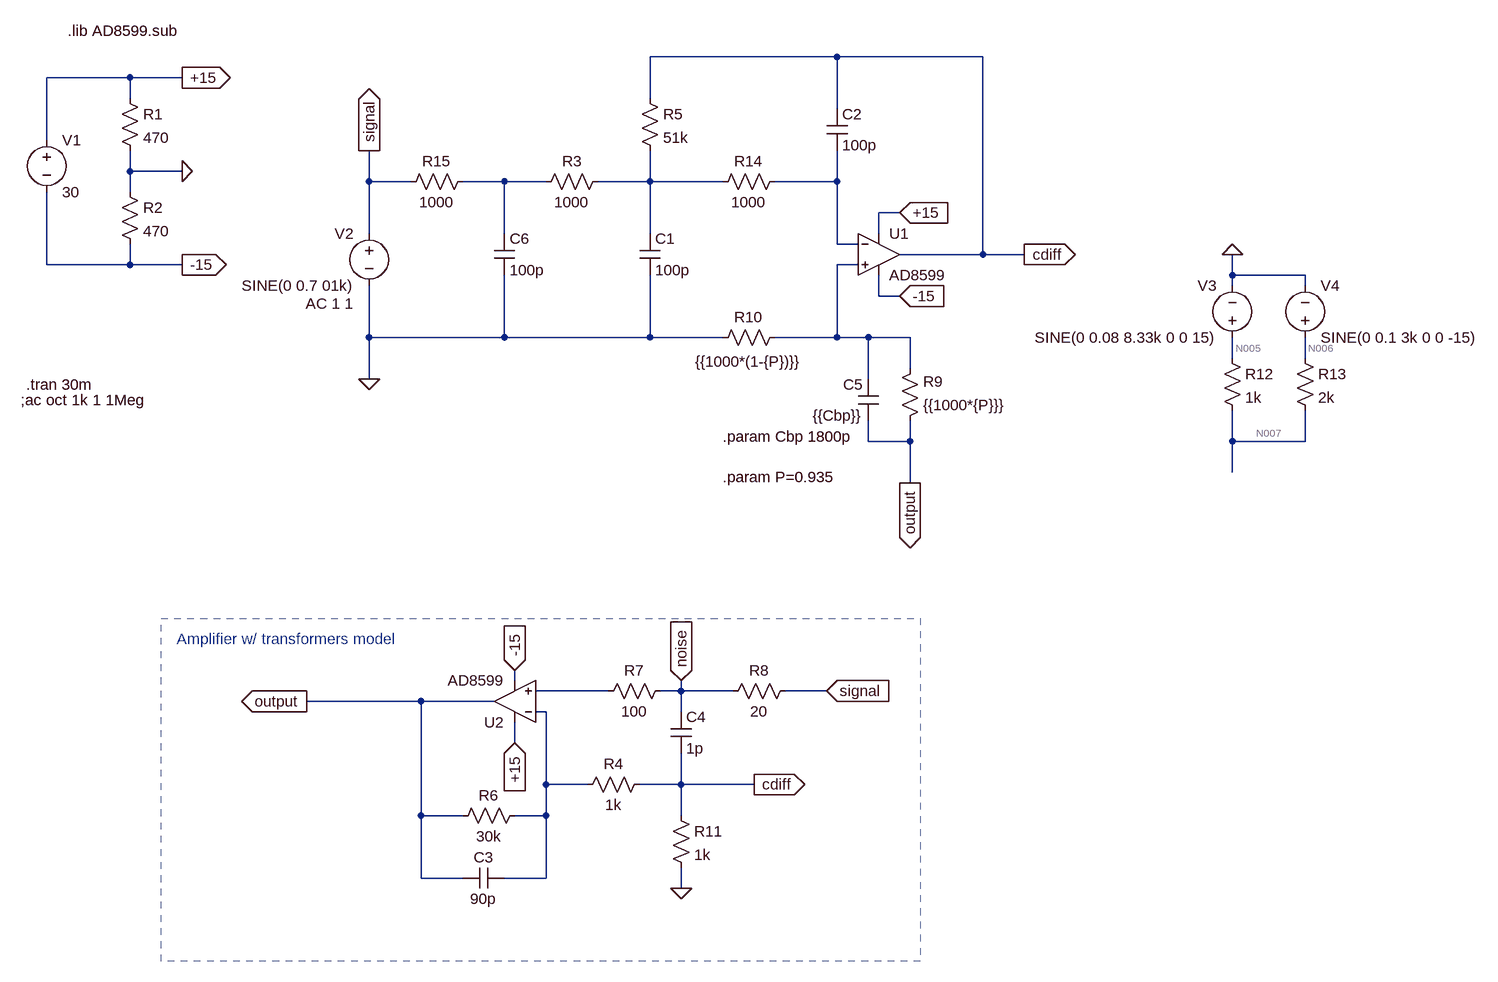
[diagram p0: schematic cdiff2.asc]
cdiff2.asc, the LTspice schematic file:
Version 4
SHEET 1 3068 2596
WIRE 1232 -160 944 -160
WIRE 1456 -160 1232 -160
WIRE 144 -128 16 -128
WIRE 224 -128 144 -128
WIRE 144 -96 144 -128
WIRE 944 -96 944 -160
WIRE 1232 -80 1232 -160
WIRE 16 -32 16 -128
WIRE 144 16 144 -16
WIRE 224 16 144 16
WIRE 512 32 512 -16
WIRE 576 32 512 32
WIRE 720 32 656 32
WIRE 784 32 720 32
WIRE 944 32 944 -16
WIRE 944 32 864 32
WIRE 1056 32 944 32
WIRE 1232 32 1232 -16
WIRE 1232 32 1136 32
WIRE 144 48 144 16
WIRE 1328 80 1296 80
WIRE 512 112 512 32
WIRE 720 112 720 32
WIRE 944 112 944 32
WIRE 1296 112 1296 80
WIRE 1232 128 1232 32
WIRE 1264 128 1232 128
WIRE 1456 144 1456 -160
WIRE 1456 144 1328 144
WIRE 1520 144 1456 144
WIRE 16 160 16 48
WIRE 144 160 144 128
WIRE 144 160 16 160
WIRE 224 160 144 160
WIRE 1264 160 1232 160
WIRE 1840 176 1840 144
WIRE 1952 176 1840 176
WIRE 1840 192 1840 176
WIRE 1952 192 1952 176
WIRE 1296 208 1296 176
WIRE 1328 208 1296 208
WIRE 512 272 512 192
WIRE 720 272 720 176
WIRE 720 272 512 272
WIRE 944 272 944 176
WIRE 944 272 720 272
WIRE 1056 272 944 272
WIRE 1232 272 1232 160
WIRE 1232 272 1136 272
WIRE 1280 272 1232 272
WIRE 1344 272 1280 272
WIRE 1840 304 1840 272
WIRE 1952 304 1952 272
WIRE 1344 320 1344 272
WIRE 512 336 512 272
WIRE 1280 336 1280 272
WIRE 1280 432 1280 400
WIRE 1344 432 1344 400
WIRE 1344 432 1280 432
WIRE 1840 432 1840 384
WIRE 1952 432 1952 384
WIRE 1952 432 1840 432
WIRE 1840 480 1840 432
WIRE 1344 496 1344 432
WIRE 736 800 736 784
WIRE 880 816 768 816
WIRE 992 816 992 800
WIRE 992 816 960 816
WIRE 1072 816 992 816
WIRE 1216 816 1152 816
WIRE 592 832 416 832
WIRE 704 832 592 832
WIRE 784 848 768 848
WIRE 992 848 992 816
WIRE 736 896 736 864
WIRE 784 960 784 848
WIRE 848 960 784 960
WIRE 992 960 992 912
WIRE 992 960 928 960
WIRE 1104 960 992 960
WIRE 592 1008 592 832
WIRE 656 1008 592 1008
WIRE 784 1008 784 960
WIRE 784 1008 736 1008
WIRE 992 1008 992 960
WIRE 592 1104 592 1008
WIRE 656 1104 592 1104
WIRE 784 1104 784 1008
WIRE 784 1104 720 1104
WIRE 992 1120 992 1088
FLAG 224 16 0
FLAG 224 -128 +15
IOPIN 224 -128 Out
FLAG 224 160 -15
IOPIN 224 160 Out
FLAG 1328 80 +15
IOPIN 1328 80 In
FLAG 1328 208 -15
IOPIN 1328 208 In
FLAG 512 336 0
FLAG 512 -16 signal
IOPIN 512 -16 Out
FLAG 992 1120 0
FLAG 1216 816 signal
IOPIN 1216 816 In
FLAG 736 896 +15
IOPIN 736 896 In
FLAG 736 784 -15
IOPIN 736 784 In
FLAG 416 832 output
IOPIN 416 832 Out
FLAG 1840 144 0
FLAG 992 800 noise
IOPIN 992 800 In
FLAG 1104 960 cdiff
IOPIN 1104 960 Out
FLAG 1344 496 output
IOPIN 1344 496 Out
FLAG 1520 144 cdiff
IOPIN 1520 144 Out
SYMBOL voltage 16 -48 R0
WINDOW 123 0 0 Left 2
WINDOW 39 0 0 Left 2
SYMATTR InstName V1
SYMATTR Value 30
SYMBOL res 128 -112 R0
SYMATTR InstName R1
SYMATTR Value 470
SYMBOL res 128 32 R0
SYMATTR InstName R2
SYMATTR Value 470
SYMBOL voltage 512 96 M0
WINDOW 123 24 124 Left 2
WINDOW 39 0 0 Left 2
SYMATTR Value2 AC 1 1
SYMATTR InstName V2
SYMATTR Value SINE(0 0.7 01k)
SYMBOL res 880 16 R90
WINDOW 0 0 56 VBottom 2
WINDOW 3 32 56 VTop 2
SYMATTR InstName R3
SYMATTR Value 1000
SYMBOL cap 928 112 R0
SYMATTR InstName C1
SYMATTR Value 100p
SYMBOL res 928 -112 R0
SYMATTR InstName R5
SYMATTR Value 51k
SYMBOL cap 1216 -80 R0
SYMATTR InstName C2
SYMATTR Value 100p
SYMBOL Opamps\\AD8599 1296 80 R0
SYMATTR InstName U1
SYMBOL Opamps\\AD8599 736 896 R180
SYMATTR InstName U2
SYMBOL res 976 800 R90
WINDOW 0 0 56 VBottom 2
WINDOW 3 32 56 VTop 2
SYMATTR InstName R7
SYMATTR Value 100
SYMBOL res 1168 800 R90
WINDOW 0 0 56 VBottom 2
WINDOW 3 32 56 VTop 2
SYMATTR InstName R8
SYMATTR Value 20
SYMBOL res 1328 416 M180
WINDOW 0 36 76 Left 2
WINDOW 3 36 40 Left 2
SYMATTR InstName R9
SYMATTR Value {{1000*{P}}}
SYMBOL res 1152 256 R90
WINDOW 0 0 56 VBottom 2
WINDOW 3 37 55 VTop 2
SYMATTR InstName R10
SYMATTR Value {{1000*(1-{P})}}
SYMBOL res 752 992 R90
WINDOW 0 0 56 VBottom 2
WINDOW 3 32 56 VTop 2
SYMATTR InstName R6
SYMATTR Value 30k
SYMBOL cap 720 1088 R90
WINDOW 0 0 32 VBottom 2
WINDOW 3 32 32 VTop 2
SYMATTR InstName C3
SYMATTR Value 90p
SYMBOL cap 976 848 R0
SYMATTR InstName C4
SYMATTR Value 1p
SYMBOL res 976 992 R0
SYMATTR InstName R11
SYMATTR Value 1k
SYMBOL voltage 1840 288 R180
WINDOW 0 24 96 Left 2
WINDOW 3 24 16 Left 2
WINDOW 123 0 0 Left 2
WINDOW 39 0 0 Left 2
SYMATTR InstName V3
SYMATTR Value SINE(0 0.08 8.33k 0 0 15)
SYMBOL res 1824 288 R0
SYMATTR InstName R12
SYMATTR Value 1k
SYMBOL voltage 1952 288 M180
WINDOW 0 24 96 Left 2
WINDOW 3 24 16 Left 2
WINDOW 123 0 0 Left 2
WINDOW 39 0 0 Left 2
SYMATTR InstName V4
SYMATTR Value SINE(0 0.1 3k 0 0 -15)
SYMBOL res 1936 288 R0
SYMATTR InstName R13
SYMATTR Value 2k
SYMBOL res 944 944 R90
WINDOW 0 0 56 VBottom 2
WINDOW 3 32 56 VTop 2
SYMATTR InstName R4
SYMATTR Value 1k
SYMBOL cap 1296 336 M0
SYMATTR InstName C5
SYMATTR Value {{Cbp}}
SYMBOL res 1152 16 R90
WINDOW 0 0 56 VBottom 2
WINDOW 3 32 56 VTop 2
SYMATTR InstName R14
SYMATTR Value 1000
SYMBOL cap 704 112 R0
SYMATTR InstName C6
SYMATTR Value 100p
SYMBOL res 672 16 R90
WINDOW 0 0 56 VBottom 2
WINDOW 3 32 56 VTop 2
SYMATTR InstName R15
SYMATTR Value 1000
TEXT -16 344 Left 2 !.tran 30m
TEXT -24 368 Left 2 !;ac oct 1k 1 1Meg
TEXT 48 -200 Left 2 !.lib AD8599.sub
TEXT 216 736 Left 2 ;Amplifier w/ transformers model
TEXT 1056 424 Left 2 !.param Cbp 1800p\n \n.param P=0.935
RECTANGLE Normal 1360 1232 192 704 2

The netlist it stands for:
* cdiff2.asc
V1 +15 -15 30
R1 +15 0 470
R2 0 -15 470
V2 signal 0 SINE(0 0.7 01k) AC 1 1
R3 N002 N001 1000
C1 N002 0 100p
R5 cdiff N002 51k
C2 cdiff N003 100p
XU1 N004 N003 +15 -15 cdiff AD8599  ; pins In+ In- V+ V- OUT
XU2 N008 N009 +15 -15 output AD8599  ; pins In+ In- V+ V- OUT
R7 noise N008 100
R8 signal noise 20
R9 output N004 {{1000*{P}}}
R10 N004 0 {{1000*(1-{P})}}
R6 N009 output 30k
C3 N009 output 90p
C4 noise cdiff 1p
R11 cdiff 0 1k
V3 N005 0 SINE(0 0.08 8.33k 0 0 15)
R12 N005 N007 1k
V4 N006 0 SINE(0 0.1 3k 0 0 -15)
R13 N006 N007 2k
R4 cdiff N009 1k
C5 N004 output {{Cbp}}
R14 N003 N002 1000
C6 N001 0 100p
R15 N001 signal 1000
.tran 30m
;ac oct 1k 1 1Meg
.lib AD8599.sub
* Amplifier w/ transformers model
.param Cbp 1800p
.param P=0.935
.backanno
.end

* Results of the author's LTspice run, read from the files saved beside the schematic
* Operating Point, zero values left out:
*   V(+15) = 15 V
*   V(-15) = -15 V
*   V(output) = 35.74 nV
*   V(n005) = 20.71 mV
*   V(n007) = 5.176 mV
*   V(n006) = -25.88 mV
*   I(R15) = 1.202 pA
*   I(R14) = 1.265 pA
*   I(R4) = -2.403 pA
*   I(R13) = -15.53 µA
*   I(R12) = 15.53 µA
*   I(R6) = -1.138 pA
*   I(R10) = 39.73 pA
*   I(R9) = 35.46 pA
*   I(R8) = -4.275 pA
*   I(R7) = -4.275 pA
*   I(R3) = 1.202 pA
*   I(R2) = 31.91 mA
*   I(R1) = 31.91 mA
*   I(V4) = 15.53 µA
*   I(V3) = -15.53 µA
*   I(V2) = 5.477 pA
*   I(V1) = -41.48 mA
*   Ix(u1:7) = 4.784 mA
*   Ix(u1:4) = -4.784 mA
*   Ix(u1:6) = 3.269 pA
*   Ix(u1:3) = -4.275 pA
*   Ix(u1:2) = -1.265 pA
*   Ix(u2:7) = 4.784 mA
*   Ix(u2:4) = -4.784 mA
*   Ix(u2:6) = -36.6 pA
*   Ix(u2:3) = -4.275 pA
*   Ix(u2:2) = -1.265 pA
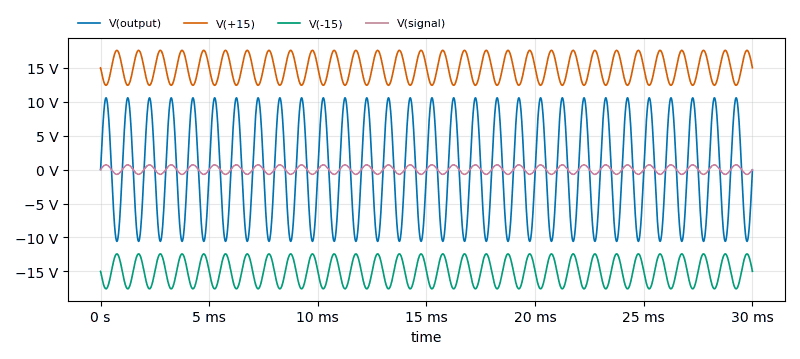
[diagram p1: Transient Analysis of cdiff2.asc, plotted from the saved traces]
* Transient Analysis, 1 run:
*   V(output): min -10.58 V, max 10.58 V, average 104.7 µV, rms 7.477 V, last -133.9 mV
*   V(+15): min 12.43 V, max 17.57 V, average 15 V, rms 15.11 V, last 15.01 V
*   V(-15): min -17.57 V, max -12.43 V, average -15 V, rms 15.11 V, last -14.99 V
*   V(signal): min -700 mV, max 700 mV, average 6.453 µV, rms 494.8 mV, last 0 V